# EAGLE schematic MusicalLights2 (EAGLE 7.2.0)
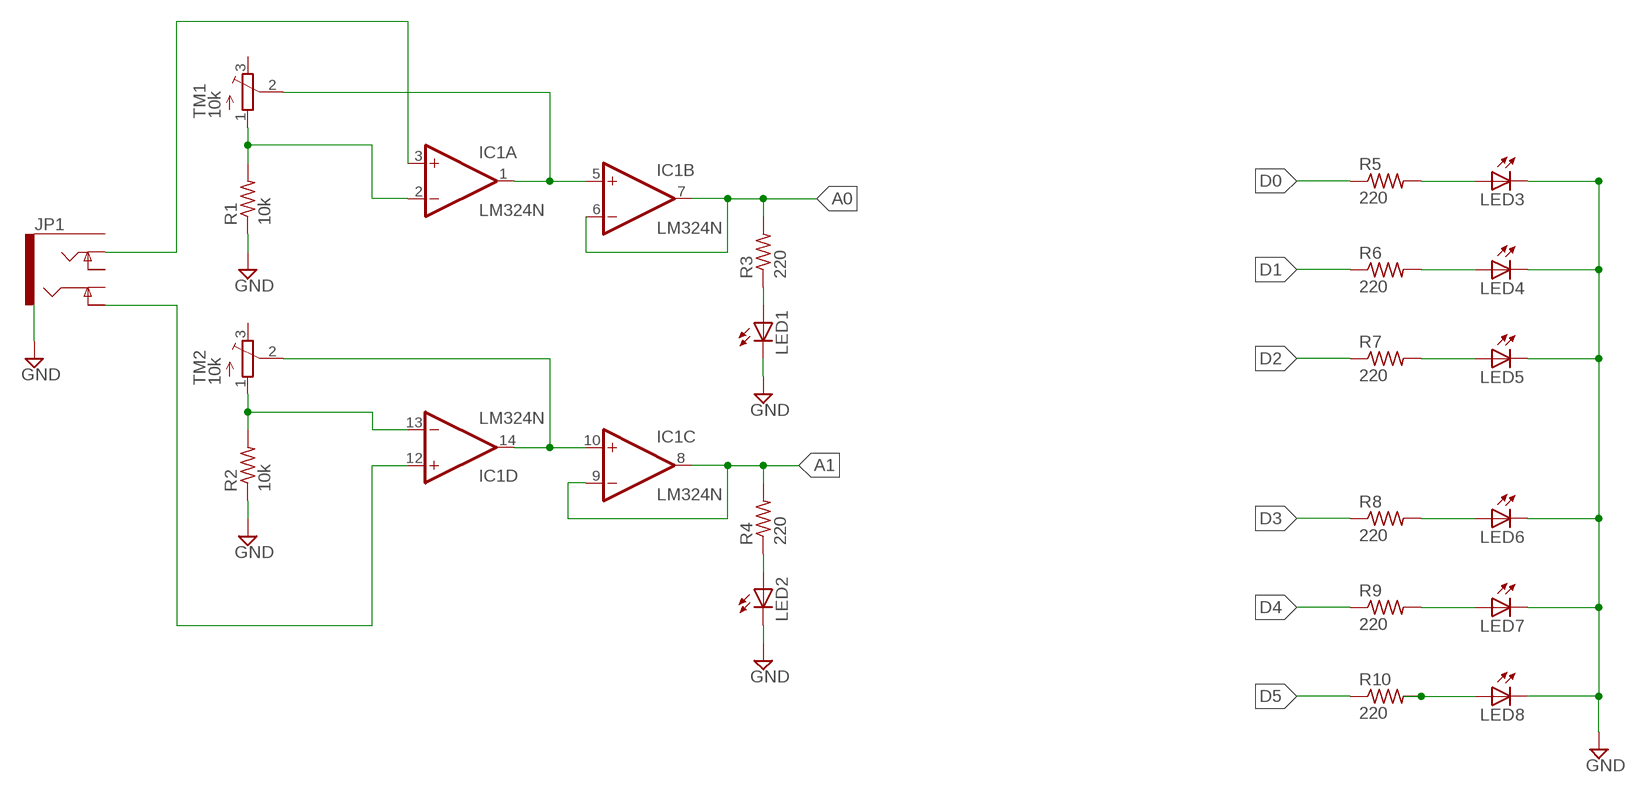
[diagram p0: schematic, sheet 1]

## Parts
IC1  LM324N  [DIL14]
JP1  AUDIO-JACK5-.25-VERT-TRS  [AUDIO-JACK-.25-INCH-VERT-PTH]
LED1  LED5MM  [LED5MM]
LED2  LED5MM  [LED5MM]
LED3  LED5MM  [LED5MM]
LED4  LED5MM  [LED5MM]
LED5  LED5MM  [LED5MM]
LED6  LED5MM  [LED5MM]
LED7  LED5MM  [LED5MM]
LED8  LED5MM  [LED5MM]
R1  10k  R-US_0207/10  [0207/10]
R2  10k  R-US_0207/10  [0207/10]
R3  220  R-US_0207/10  [0207/10]
R4  220  R-US_0207/10  [0207/10]
R5  220  R-US_0207/10  [0207/10]
R6  220  R-US_0207/10  [0207/10]
R7  220  R-US_0207/10  [0207/10]
R8  220  R-US_0207/10  [0207/10]
R9  220  R-US_0207/10  [0207/10]
R10  220  R-US_0207/10  [0207/10]
TM1  10k  TRIMPOT3386  [TRIM-3386]
TM2  10k  TRIMPOT3386  [TRIM-3386]

## Nets
A0: IC1.6(B:-IN) IC1.7(B:OUT) R3.2
A1: IC1.8(C:OUT) IC1.9(C:-IN) R4.2
D0: R5.1
D1: R6.1
D2: R7.1
D3: R8.1
D4: R9.1
D5: R10.1
GND: LED1.K(C) LED2.K(C) LED3.K(C) LED4.K(C) LED5.K(C) LED6.K(C) LED7.K(C) LED8.K(C) R1.1 R2.1
N$1: IC1.2(A:-IN) R1.2 TM1.1(A)
N$2: IC1.13(D:-IN) R2.2 TM2.1(A)
N$3: IC1.3(A:+IN) JP1.TIP
N$4: IC1.12(D:+IN) JP1.RING-NORM
N$5: IC1.1(A:OUT) IC1.5(B:+IN) TM1.2(S)
N$6: IC1.10(C:+IN) IC1.14(D:OUT) TM2.2(S)
N$7: LED3.A R5.2
N$10: LED2.A R4.1
N$11: LED1.A R3.1
N$12: LED4.A R6.2
N$13: LED5.A R7.2
N$14: LED6.A R8.2
N$15: LED7.A R9.2
N$16: LED8.A R10.2
Unconnected: JP1.RING JP1.SLEEVE(EARTH) JP1.TIP-NORM TM1.3(E) TM2.3(E)

## Power pins joined to a net without a drawn wire
V+: IC1.4(P:V+)
V-: IC1.11(P:V-)

## Library data of the parts
IC1 = linear:LM324: OP AMP
JP1 = SparkFun-Connectors:AUDIO-JACK5-.25-VERT-TRS: 1/4" TRS jack, vertical Production SKU: COM-11152 Footprint unproven - datasheet and part seem to be slightly different; PROD_ID: COM-11152
LED1-LED8 = adafruit:LED: LED OSRAM: - CHIPLED LG R971, LG N971, LY N971, LG Q971, LY Q971, LO R971, LY R971 LH N974, LH R974 LS Q976, LO Q976, LY Q976 LO Q996 - Hyper CHIPLED LW Q18S LB Q993, LB Q99A, LB R99A - SideLED LS A670, LO A670, LY A670, LG A670, LP A670 LB A673, LV A673, LT A673, LW A673 LH A674 LY A675 LS A676, LA A676, LO A676, LY A676, LW A676 LS A679, LY A679, LG A679 - Hyper Micro SIDELED® LS Y876, LA Y876, LO Y876, LY Y876 LT Y87S - SmartLED LW L88C, LW L88S LB L89C, LB L89S, LG L890 LS L89K, LO L89K, LY L89K LS L896, LA L896, LO L896, LY L896 - TOPLED LS T670, LO T670, LY T670, LG T670, LP T670 LSG T670, LSP T670, LSY T670, LOP T670, LYG T670 LG T671, LOG T671, LSG T671 LB T673, LV T673, LT T673, LW T673 LH T674 LS T676, LA T676, LO T676, LY T676, LB T676, LH T676, LSB T676, LW T676 LB T67C, LV T67C, LT T67C, LS T67K, LO T67K, LY T67K, LW E67C LS E67B, LA E67B, LO E67B, LY E67B, LB E67C, LV E67C, LT E67C LW T67C LS T679, LY T679, LG T679 LS T770, LO T770, LY T770, LG T770, LP T770 LB T773, LV T773, LT T773, LW T773 LH T774 LS E675, LA E675, LY E675, LS T675 LS T776, LA T776, LO T776, LY T776, LB T776 LHGB T686 LT T68C, LB T68C - Hyper Mini TOPLED® LB M676 - Mini TOPLED Santana® LG M470 LS M47K, LO M47K, LY M47K Source: http://www.osram.convergy.de/
R1-R10 = adafruit:R-US_: RESISTOR, American symbol
TM1 TM2 = adafruit:TRIMPOT: SMT trimmer potentiometer part number TC33X http://www.ladyada.net/library/eagle